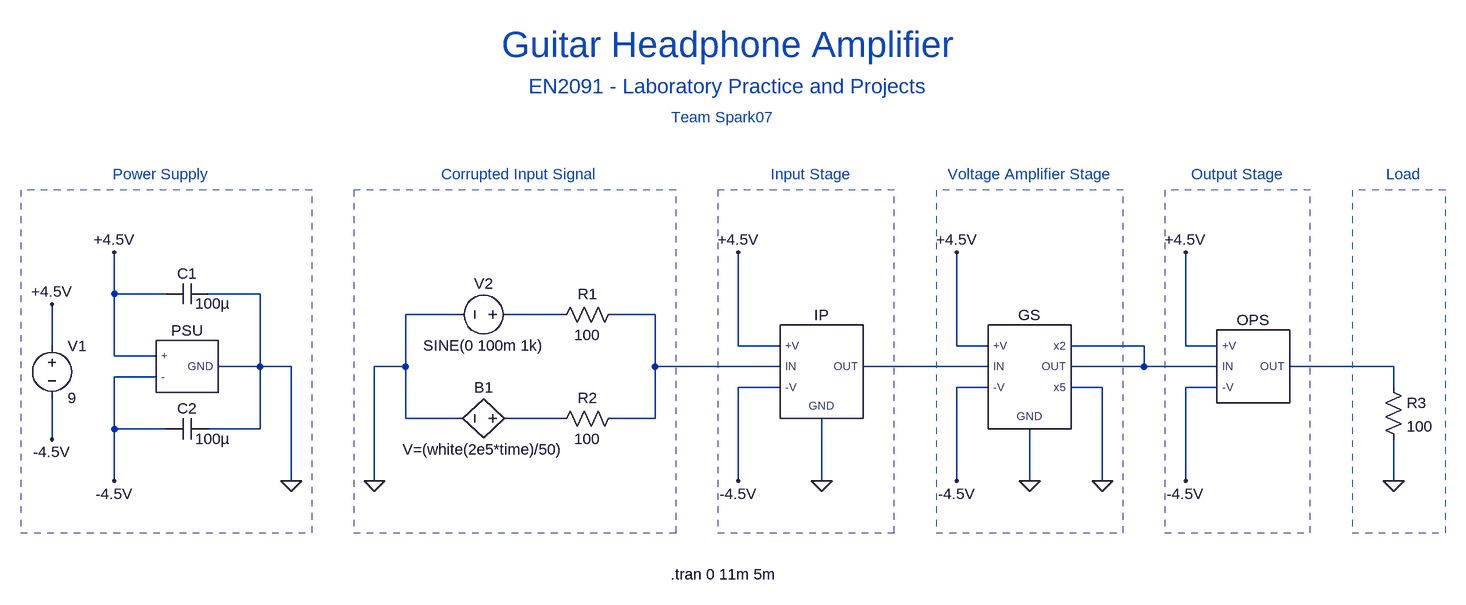
[diagram p0: schematic main.asc]
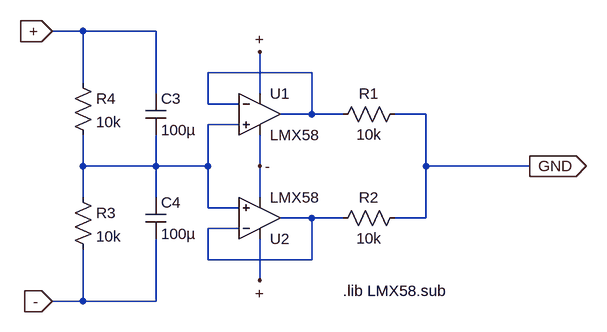
[diagram p1: sub-circuit psu.asc]
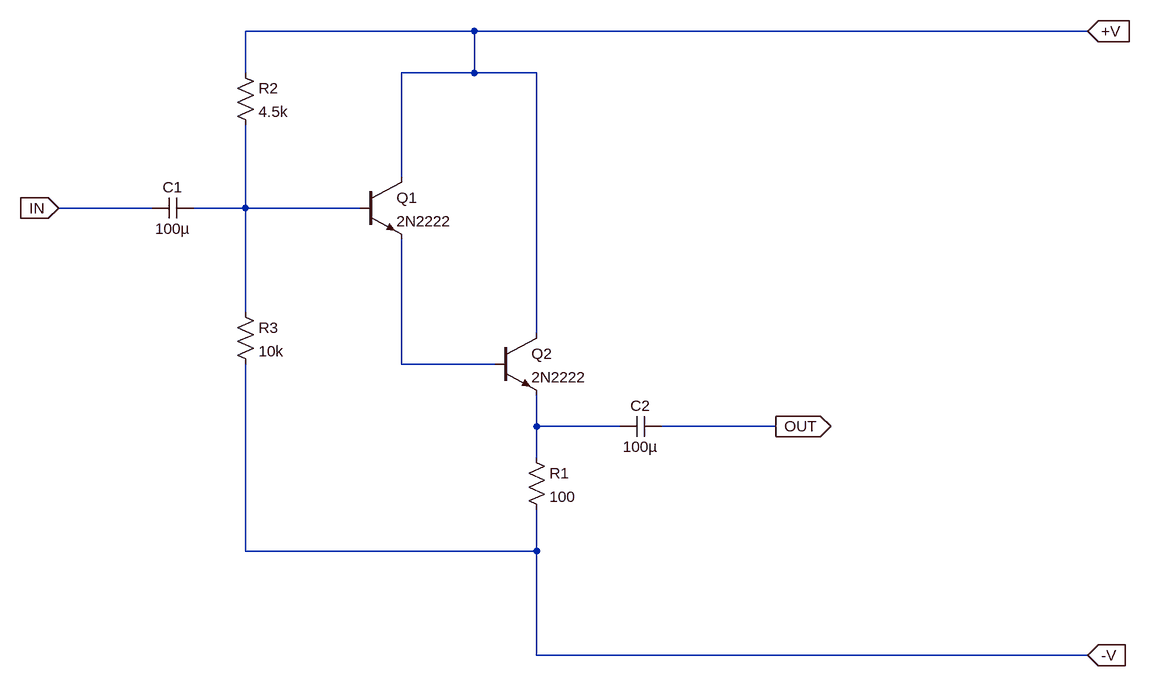
[diagram p2: sub-circuit ops.asc]
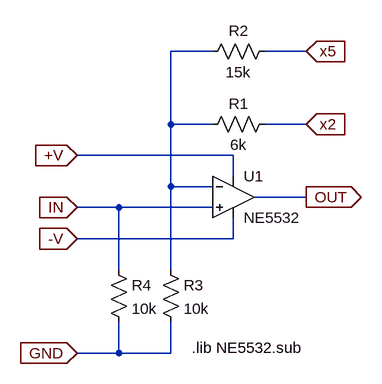
[diagram p3: sub-circuit gs.asc]
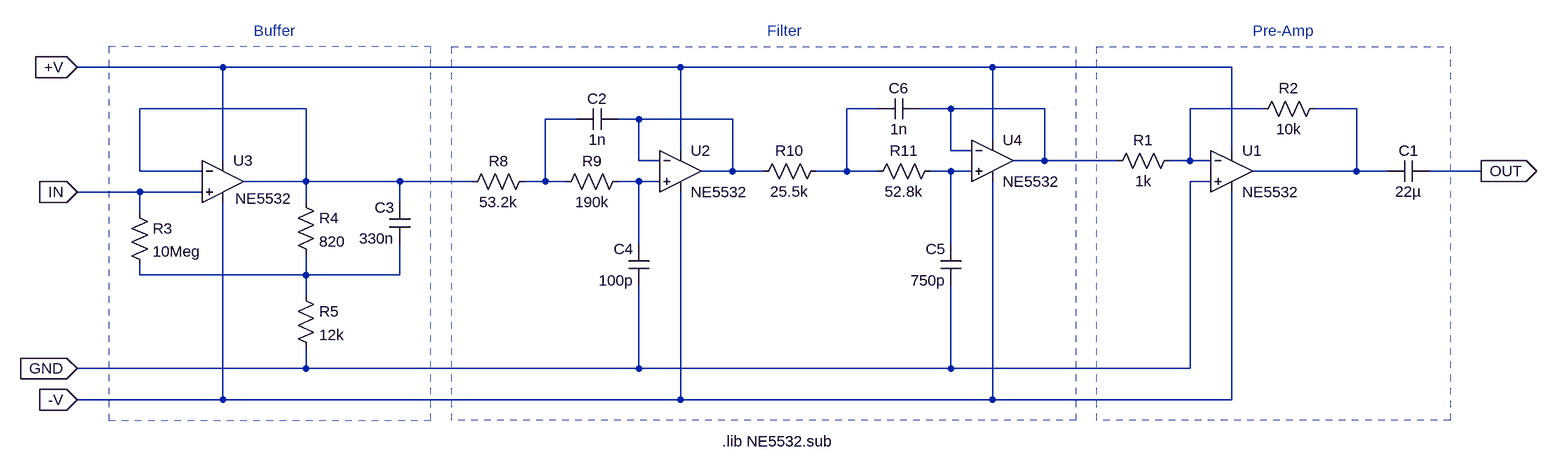
[diagram p4: sub-circuit ips_2.asc]
main.asc, the LTspice schematic file:
Version 4
SHEET 1 1848 680
WIRE -240 96 -240 32
WIRE -160 96 -240 96
WIRE -16 96 -96 96
WIRE 288 128 208 128
WIRE 448 128 368 128
WIRE 592 128 528 128
WIRE -336 176 -336 112
WIRE 720 176 720 32
WIRE 784 176 720 176
WIRE 1056 176 1056 32
WIRE 1104 176 1056 176
WIRE 1344 176 1232 176
WIRE 1408 176 1408 32
WIRE 1456 176 1408 176
WIRE -240 192 -240 96
WIRE -176 192 -240 192
WIRE -16 208 -16 96
WIRE -16 208 -80 208
WIRE 32 208 -16 208
WIRE 208 208 208 128
WIRE 208 208 160 208
WIRE 592 208 592 128
WIRE 784 208 592 208
WIRE 1104 208 912 208
WIRE 1344 208 1344 176
WIRE 1344 208 1232 208
WIRE 1456 208 1344 208
WIRE 1728 208 1568 208
WIRE -176 224 -240 224
WIRE 784 240 720 240
WIRE 1104 240 1056 240
WIRE 1280 240 1232 240
WIRE 1456 240 1408 240
WIRE 1728 240 1728 208
WIRE 208 288 208 208
WIRE 288 288 208 288
WIRE 448 288 368 288
WIRE 592 288 592 208
WIRE 592 288 528 288
WIRE -240 304 -240 224
WIRE -160 304 -240 304
WIRE -16 304 -16 208
WIRE -16 304 -96 304
WIRE -336 320 -336 256
WIRE -240 384 -240 304
WIRE 32 384 32 208
WIRE 160 384 160 208
WIRE 720 384 720 240
WIRE 848 384 848 288
WIRE 1056 384 1056 240
WIRE 1168 384 1168 304
WIRE 1280 384 1280 240
WIRE 1408 384 1408 240
WIRE 1728 384 1728 320
FLAG -336 112 +4.5V
FLAG -336 320 -4.5V
FLAG -240 32 +4.5V
FLAG -240 384 -4.5V
FLAG 32 384 0
FLAG 160 384 0
FLAG 720 32 +4.5V
FLAG 720 384 -4.5V
FLAG 848 384 0
FLAG 1056 32 +4.5V
FLAG 1056 384 -4.5V
FLAG 1168 384 0
FLAG 1408 32 +4.5V
FLAG 1408 384 -4.5V
FLAG 1728 384 0
FLAG 1280 384 0
SYMBOL PSU -128 208 R0
SYMATTR InstName PSU
SYMBOL voltage -336 160 R0
WINDOW 123 0 0 Left 0
WINDOW 39 0 0 Left 0
SYMATTR InstName V1
SYMATTR Value 9
SYMBOL cap -96 80 R90
WINDOW 0 0 32 VBottom 2
WINDOW 3 31 20 VLeft 2
SYMATTR InstName C1
SYMATTR Value 100µ
SYMBOL cap -96 288 R90
WINDOW 0 0 32 VBottom 2
WINDOW 3 31 20 VLeft 2
SYMATTR InstName C2
SYMATTR Value 100µ
SYMBOL voltage 384 128 R90
WINDOW 0 -32 56 VBottom 2
WINDOW 3 32 56 VTop 2
WINDOW 123 60 56 VTop 2
WINDOW 39 0 0 Left 0
SYMATTR InstName V2
SYMATTR Value SINE(0 100m 1k)
SYMBOL OPS 1504 208 R0
SYMATTR InstName OPS
SYMBOL bv 384 288 R90
WINDOW 0 -32 56 VBottom 2
WINDOW 3 32 56 VTop 2
SYMATTR InstName B1
SYMATTR Value V=(white(2e5*time)/50)
SYMBOL res 544 112 R90
WINDOW 0 0 56 VBottom 2
WINDOW 3 32 56 VTop 2
SYMATTR InstName R1
SYMATTR Value 100
SYMBOL GS 1168 224 R0
SYMATTR InstName GS
SYMBOL res 1712 224 R0
SYMATTR InstName R3
SYMATTR Value 100
SYMBOL res 544 272 R90
WINDOW 0 0 56 VBottom 2
WINDOW 3 32 56 VTop 2
SYMATTR InstName R2
SYMATTR Value 100
SYMBOL IPS_2 848 224 R0
SYMATTR InstName IP
TEXT 616 528 Left 2 !.tran 0 11m 5m
TEXT 832 -88 Center 2 ;Input Stage
TEXT 1168 -88 Center 2 ;Voltage Amplifier Stage
TEXT 1488 -88 Center 2 ;Output Stage
TEXT 384 -88 Center 2 ;Corrupted Input Signal
TEXT -168 -88 Center 2 ;Power Supply
TEXT 1744 -88 Center 2 ;Load
TEXT 704 -288 Center 5 ;Guitar Headphone Amplifier
TEXT 704 -224 Center 3 ;EN2091 - Laboratory Practice and Projects
TEXT 696 -176 Center 2 ;Team Spark07
RECTANGLE Normal 1600 -64 1376 464 2
RECTANGLE Normal 1312 -64 1024 464 2
RECTANGLE Normal 960 -64 688 464 2
RECTANGLE Normal 64 -64 -384 464 2
RECTANGLE Normal 624 -64 128 464 2
RECTANGLE Normal 1808 -64 1664 464 2

psu.asc, the sub-circuit schematic file:
Version 4
SHEET 1 880 680
WIRE -32 -48 -80 -48
WIRE 80 -48 -32 -48
WIRE 320 16 160 16
WIRE -32 32 -32 -48
WIRE 80 48 80 -48
WIRE 240 48 240 -16
WIRE 160 64 160 16
WIRE 208 64 160 64
WIRE 320 80 320 16
WIRE 320 80 272 80
WIRE 368 80 320 80
WIRE 496 80 448 80
WIRE 208 96 160 96
WIRE -32 160 -32 112
WIRE 80 160 80 112
WIRE 80 160 -32 160
WIRE 160 160 160 96
WIRE 160 160 80 160
WIRE 240 160 240 112
WIRE 496 160 496 80
WIRE 656 160 496 160
WIRE -32 208 -32 160
WIRE 80 208 80 160
WIRE 240 208 240 160
WIRE 160 224 160 160
WIRE 208 224 160 224
WIRE 320 240 272 240
WIRE 368 240 320 240
WIRE 496 240 496 160
WIRE 496 240 448 240
WIRE 208 256 160 256
WIRE 160 304 160 256
WIRE 320 304 320 240
WIRE 320 304 160 304
WIRE 240 336 240 272
WIRE -32 368 -32 288
WIRE -32 368 -80 368
WIRE 80 368 80 272
WIRE 80 368 -32 368
FLAG 656 160 GND
IOPIN 656 160 Out
FLAG 240 -16 +
FLAG 240 336 +
FLAG 240 160 -
FLAG -80 -48 +
IOPIN -80 -48 In
FLAG -80 368 -
IOPIN -80 368 In
SYMBOL res 464 64 R90
WINDOW 0 0 56 VBottom 2
WINDOW 3 32 56 VTop 2
SYMATTR InstName R1
SYMATTR Value 10k
SYMBOL res 464 224 R90
WINDOW 0 0 56 VBottom 2
WINDOW 3 32 56 VTop 2
SYMATTR InstName R2
SYMATTR Value 10k
SYMBOL cap 64 48 R0
SYMATTR InstName C3
SYMATTR Value 100µ
SYMBOL cap 64 208 R0
SYMATTR InstName C4
SYMATTR Value 100µ
SYMBOL res -48 192 R0
SYMATTR InstName R3
SYMATTR Value 10k
SYMBOL res -48 16 R0
SYMATTR InstName R4
SYMATTR Value 10k
SYMBOL OpAmps\\opamp2 240 16 R0
SYMATTR InstName U1
SYMATTR Value LMX58
SYMBOL OpAmps\\opamp2 240 304 M180
SYMATTR InstName U2
SYMATTR Value LMX58
TEXT 368 352 Left 2 !.lib LMX58.sub

ops.asc, the sub-circuit schematic file:
Version 4
SHEET 1 1588 840
WIRE 384 -192 32 -192
WIRE 1328 -192 384 -192
WIRE 32 -128 32 -192
WIRE 384 -128 384 -192
WIRE 384 -128 272 -128
WIRE 480 -128 384 -128
WIRE 272 32 272 -128
WIRE -112 80 -256 80
WIRE 32 80 32 -48
WIRE 32 80 -48 80
WIRE 208 80 32 80
WIRE 32 240 32 80
WIRE 480 272 480 -128
WIRE 272 320 272 128
WIRE 416 320 272 320
WIRE 480 416 480 368
WIRE 608 416 480 416
WIRE 848 416 672 416
WIRE 480 464 480 416
WIRE 32 608 32 320
WIRE 480 608 480 544
WIRE 480 608 32 608
WIRE 480 768 480 608
WIRE 1328 768 480 768
FLAG 1328 -192 +V
IOPIN 1328 -192 In
FLAG 1328 768 -V
IOPIN 1328 768 In
FLAG 848 416 OUT
IOPIN 848 416 Out
FLAG -256 80 IN
IOPIN -256 80 In
SYMBOL npn 208 32 R0
SYMATTR InstName Q1
SYMATTR Value 2N2222
SYMBOL npn 416 272 R0
SYMATTR InstName Q2
SYMATTR Value 2N2222
SYMBOL res 464 448 R0
SYMATTR InstName R1
SYMATTR Value 100
SYMBOL res 16 -144 R0
SYMATTR InstName R2
SYMATTR Value 4.5k
SYMBOL res 16 224 R0
SYMATTR InstName R3
SYMATTR Value 10k
SYMBOL cap 672 400 R90
WINDOW 0 0 32 VBottom 2
WINDOW 3 32 32 VTop 2
SYMATTR InstName C2
SYMATTR Value 100µ
SYMBOL cap -48 64 R90
WINDOW 0 0 32 VBottom 2
WINDOW 3 32 32 VTop 2
SYMATTR InstName C1
SYMATTR Value 100µ

gs.asc, the sub-circuit schematic file:
Version 4
SHEET 1 880 680
WIRE 176 -64 112 -64
WIRE 320 -64 256 -64
WIRE 112 48 112 -64
WIRE 176 48 112 48
WIRE 320 48 256 48
WIRE 208 96 -32 96
WIRE 208 128 208 96
WIRE 112 144 112 48
WIRE 176 144 112 144
WIRE 320 160 240 160
WIRE 32 176 -32 176
WIRE 176 176 32 176
WIRE 208 224 208 192
WIRE 208 224 -32 224
WIRE 32 272 32 176
WIRE 112 272 112 144
WIRE 32 400 32 352
WIRE 32 400 -32 400
WIRE 112 400 112 352
WIRE 112 400 32 400
FLAG -32 176 IN
IOPIN -32 176 In
FLAG -32 96 +V
IOPIN -32 96 In
FLAG -32 224 -V
IOPIN -32 224 In
FLAG -32 400 GND
IOPIN -32 400 In
FLAG 320 48 x2
IOPIN 320 48 In
FLAG 320 -64 x5
IOPIN 320 -64 In
FLAG 320 160 OUT
IOPIN 320 160 Out
SYMBOL res 272 -80 R90
WINDOW 0 0 56 VBottom 2
WINDOW 3 32 56 VTop 2
SYMATTR InstName R2
SYMATTR Value 15k
SYMBOL res 96 256 R0
SYMATTR InstName R3
SYMATTR Value 10k
SYMBOL res 272 32 R90
WINDOW 0 0 56 VBottom 2
WINDOW 3 32 56 VTop 2
SYMATTR InstName R1
SYMATTR Value 6k
SYMBOL OpAmps\\opamp2 208 96 R0
SYMATTR InstName U1
SYMATTR Value NE5532
SYMBOL res 16 256 R0
SYMATTR InstName R4
SYMATTR Value 10k
TEXT 144 392 Left 2 !.lib NE5532.sub

ips_2.asc, the sub-circuit schematic file:
Version 4
SHEET 1 2132 680
WIRE -320 -112 -544 -112
WIRE 384 -112 -320 -112
WIRE 864 -112 384 -112
WIRE 1232 -112 864 -112
WIRE -192 -48 -448 -48
WIRE 688 -48 640 -48
WIRE 800 -48 752 -48
WIRE 944 -48 800 -48
WIRE 1280 -48 1168 -48
WIRE 1424 -48 1360 -48
WIRE 224 -32 176 -32
WIRE 320 -32 288 -32
WIRE 464 -32 320 -32
WIRE 864 0 864 -112
WIRE 384 16 384 -112
WIRE 800 16 800 -48
WIRE 832 16 800 16
WIRE 1232 16 1232 -112
WIRE -320 32 -320 -112
WIRE 320 32 320 -32
WIRE 352 32 320 32
WIRE 944 32 944 -48
WIRE 944 32 896 32
WIRE 1056 32 944 32
WIRE 1168 32 1168 -48
WIRE 1168 32 1136 32
WIRE 1200 32 1168 32
WIRE -448 48 -448 -48
WIRE -352 48 -448 48
WIRE 464 48 464 -32
WIRE 464 48 416 48
WIRE 512 48 464 48
WIRE 640 48 640 -48
WIRE 640 48 592 48
WIRE 688 48 640 48
WIRE 800 48 768 48
WIRE 832 48 800 48
WIRE 1424 48 1424 -48
WIRE 1424 48 1264 48
WIRE 1472 48 1424 48
WIRE 1616 48 1536 48
WIRE -192 64 -192 -48
WIRE -192 64 -288 64
WIRE -48 64 -192 64
WIRE 64 64 -48 64
WIRE 176 64 176 -32
WIRE 176 64 144 64
WIRE 208 64 176 64
WIRE 320 64 288 64
WIRE 352 64 320 64
WIRE 1200 64 1168 64
WIRE -448 80 -544 80
WIRE -352 80 -448 80
WIRE -192 96 -192 64
WIRE -48 96 -48 64
WIRE -448 112 -448 80
WIRE 320 160 320 64
WIRE 800 160 800 48
WIRE -448 208 -448 192
WIRE -192 208 -192 176
WIRE -192 208 -448 208
WIRE -48 208 -48 160
WIRE -48 208 -192 208
WIRE -192 240 -192 208
WIRE -192 352 -192 320
WIRE -192 352 -544 352
WIRE 320 352 320 224
WIRE 320 352 -192 352
WIRE 800 352 800 224
WIRE 800 352 320 352
WIRE 1168 352 1168 64
WIRE 1168 352 800 352
WIRE -320 400 -320 96
WIRE -320 400 -544 400
WIRE 384 400 384 80
WIRE 384 400 -320 400
WIRE 864 400 864 64
WIRE 864 400 384 400
WIRE 1232 400 1232 80
WIRE 1232 400 864 400
FLAG -544 80 IN
IOPIN -544 80 In
FLAG -544 352 GND
IOPIN -544 352 In
FLAG -544 -112 +V
IOPIN -544 -112 In
FLAG -544 400 -V
IOPIN -544 400 In
FLAG 1616 48 OUT
IOPIN 1616 48 Out
SYMBOL OpAmps\\opamp2 1232 -16 R0
SYMATTR InstName U1
SYMATTR Value NE5532
SYMBOL res 1152 16 R90
WINDOW 0 0 56 VBottom 2
WINDOW 3 32 56 VTop 2
SYMATTR InstName R1
SYMATTR Value 1k
SYMBOL res 1376 -64 R90
WINDOW 0 0 56 VBottom 2
WINDOW 3 32 56 VTop 2
SYMATTR InstName R2
SYMATTR Value 10k
SYMBOL cap 1536 32 R90
WINDOW 0 0 32 VBottom 2
WINDOW 3 32 32 VTop 2
SYMATTR InstName C1
SYMATTR Value 22µ
SYMBOL res -464 96 R0
SYMATTR InstName R3
SYMATTR Value 10Meg
SYMBOL OpAmps\\opamp2 -320 0 R0
WINDOW 3 19 90 Left 2
SYMATTR Value NE5532
SYMATTR InstName U3
SYMBOL cap -32 160 R180
WINDOW 0 24 56 Left 2
WINDOW 3 24 8 Left 2
SYMATTR InstName C3
SYMATTR Value 330n
SYMBOL res -208 80 R0
SYMATTR InstName R4
SYMATTR Value 820
SYMBOL res -208 224 R0
SYMATTR InstName R5
SYMATTR Value 12k
SYMBOL OpAmps\\opamp2 384 -16 R0
SYMATTR InstName U2
SYMATTR Value NE5532
SYMBOL OpAmps\\opamp2 864 -32 R0
SYMATTR InstName U4
SYMATTR Value NE5532
SYMBOL res 160 48 R90
WINDOW 0 0 56 VBottom 2
WINDOW 3 32 56 VTop 2
SYMATTR InstName R8
SYMATTR Value 53.2k
SYMBOL res 304 48 R90
WINDOW 0 0 56 VBottom 2
WINDOW 3 32 56 VTop 2
SYMATTR InstName R9
SYMATTR Value 190k
SYMBOL cap 288 -48 R90
WINDOW 0 0 32 VBottom 2
WINDOW 3 32 32 VTop 2
SYMATTR InstName C2
SYMATTR Value 1n
SYMBOL cap 336 224 R180
WINDOW 0 24 56 Left 2
WINDOW 3 24 8 Left 2
SYMATTR InstName C4
SYMATTR Value 100p
SYMBOL res 608 32 R90
WINDOW 0 0 56 VBottom 2
WINDOW 3 32 56 VTop 2
SYMATTR InstName R10
SYMATTR Value 25.5k
SYMBOL res 784 32 R90
WINDOW 0 0 56 VBottom 2
WINDOW 3 32 56 VTop 2
SYMATTR InstName R11
SYMATTR Value 52.8k
SYMBOL cap 752 -64 R90
WINDOW 0 0 32 VBottom 2
WINDOW 3 32 32 VTop 2
SYMATTR InstName C6
SYMATTR Value 1n
SYMBOL cap 816 224 R180
WINDOW 0 24 56 Left 2
WINDOW 3 24 8 Left 2
SYMATTR InstName C5
SYMATTR Value 750p
TEXT 448 464 Left 2 !.lib NE5532.sub
TEXT -240 -168 Center 2 ;Buffer
TEXT 1312 -168 Center 2 ;Pre-Amp
TEXT 544 -168 Center 2 ;Filter
RECTANGLE Normal -496 432 0 -144 2
RECTANGLE Normal 992 432 32 -144 2
RECTANGLE Normal 1568 432 1024 -144 2

The netlist it stands for:
* main.asc
XPSU +4.5V -4.5V 0 psu
V1 +4.5V -4.5V 9
C1 0 +4.5V 100µ
C2 0 -4.5V 100µ
V2 N001 0 SINE(0 100m 1k)
XOPS +4.5V -4.5V N003 N005 ops
B1 N006 0 V=(white(2e5*time)/50)
R1 N002 N001 100
XGS +4.5V -4.5V 0 N004 N003 0 N003 gs
R3 N005 0 100
R2 N002 N006 100
XIP +4.5V -4.5V 0 N002 N004 ips_2

* block symbol definitions
.subckt psu + - GND
R1 GND N001 10k
R2 GND N003 10k
C3 + N002 100µ
C4 N002 - 100µ
R3 N002 - 10k
R4 + N002 10k
XU1 N002 N001 + - N001 LMX58  ; pins In+ In- V+ V- OUT
XU2 N002 N003 + - N003 LMX58  ; pins In+ In- V+ V- OUT
.lib LMX58.sub
.ends psu

.subckt ops +V -V IN OUT
Q1 +V N001 N002 0 2N2222
Q2 +V N002 N003 0 2N2222
R1 N003 -V 100
R2 +V N001 4.5k
R3 N001 -V 10k
C2 OUT N003 100µ
C1 N001 IN 100µ
.ends ops

.subckt gs +V -V GND IN x2 x5 OUT
R2 x5 N001 15k
R3 N001 GND 10k
R1 x2 N001 6k
XU1 IN N001 +V -V OUT NE5532  ; pins In+ In- V+ V- OUT
R4 IN GND 10k
.lib NE5532.sub
.ends gs

.subckt ips_2 +V -V GND IN OUT
XU1 GND N004 +V -V N005 NE5532  ; pins In+ In- V+ V- OUT
R1 N004 N003 1k
R2 N005 N004 10k
C1 OUT N005 22µ
R3 IN N010 10Meg
XU3 IN N001 +V -V N001 NE5532  ; pins In+ In- V+ V- OUT
C3 N010 N001 330n
R4 N001 N010 820
R5 N010 GND 12k
XU2 N009 N007 +V -V N007 NE5532  ; pins In+ In- V+ V- OUT
XU4 N008 N003 +V -V N003 NE5532  ; pins In+ In- V+ V- OUT
R8 N006 N001 53.2k
R9 N009 N006 190k
C2 N007 N006 1n
C4 GND N009 100p
R10 N002 N007 25.5k
R11 N008 N002 52.8k
C6 N003 N002 1n
C5 GND N008 750p
.lib NE5532.sub
* Buffer
* Pre-Amp
* Filter
.ends ips_2

.model NPN NPN
.model PNP PNP
.lib standard.bjt
.tran 0 11m 5m
* Input Stage
* Voltage Amplifier Stage
* Output Stage
* Corrupted Input Signal
* Power Supply
* Load
* Guitar Headphone Amplifier
* EN2091 - Laboratory Practice and Projects
* Team Spark07
.backanno
.end